# Altium schematic sheet LoraPic.SchDoc
size 420 x 297 mm; Address1: Address1; Address2: Address2; Address3: Address3; Address4: Address4; SheetNumber: 1; Scale: 1:1; Разраб.: Иванов; Обозначение документа: АБВГ.123456.001 Э3; Пров.: Петров; Утв.: Сидоров; Наименование организации: ОАО "Ваша фирма"; Перв. применение: АБВГ.123456.000; Наименование изделия 1: Плата; Наименование изделия 2: Схема электрическая; Наименование изделия 3: принципиальная; Нач. отд.: Нач. отд.; Фамилия нач. отд.: Сидоров
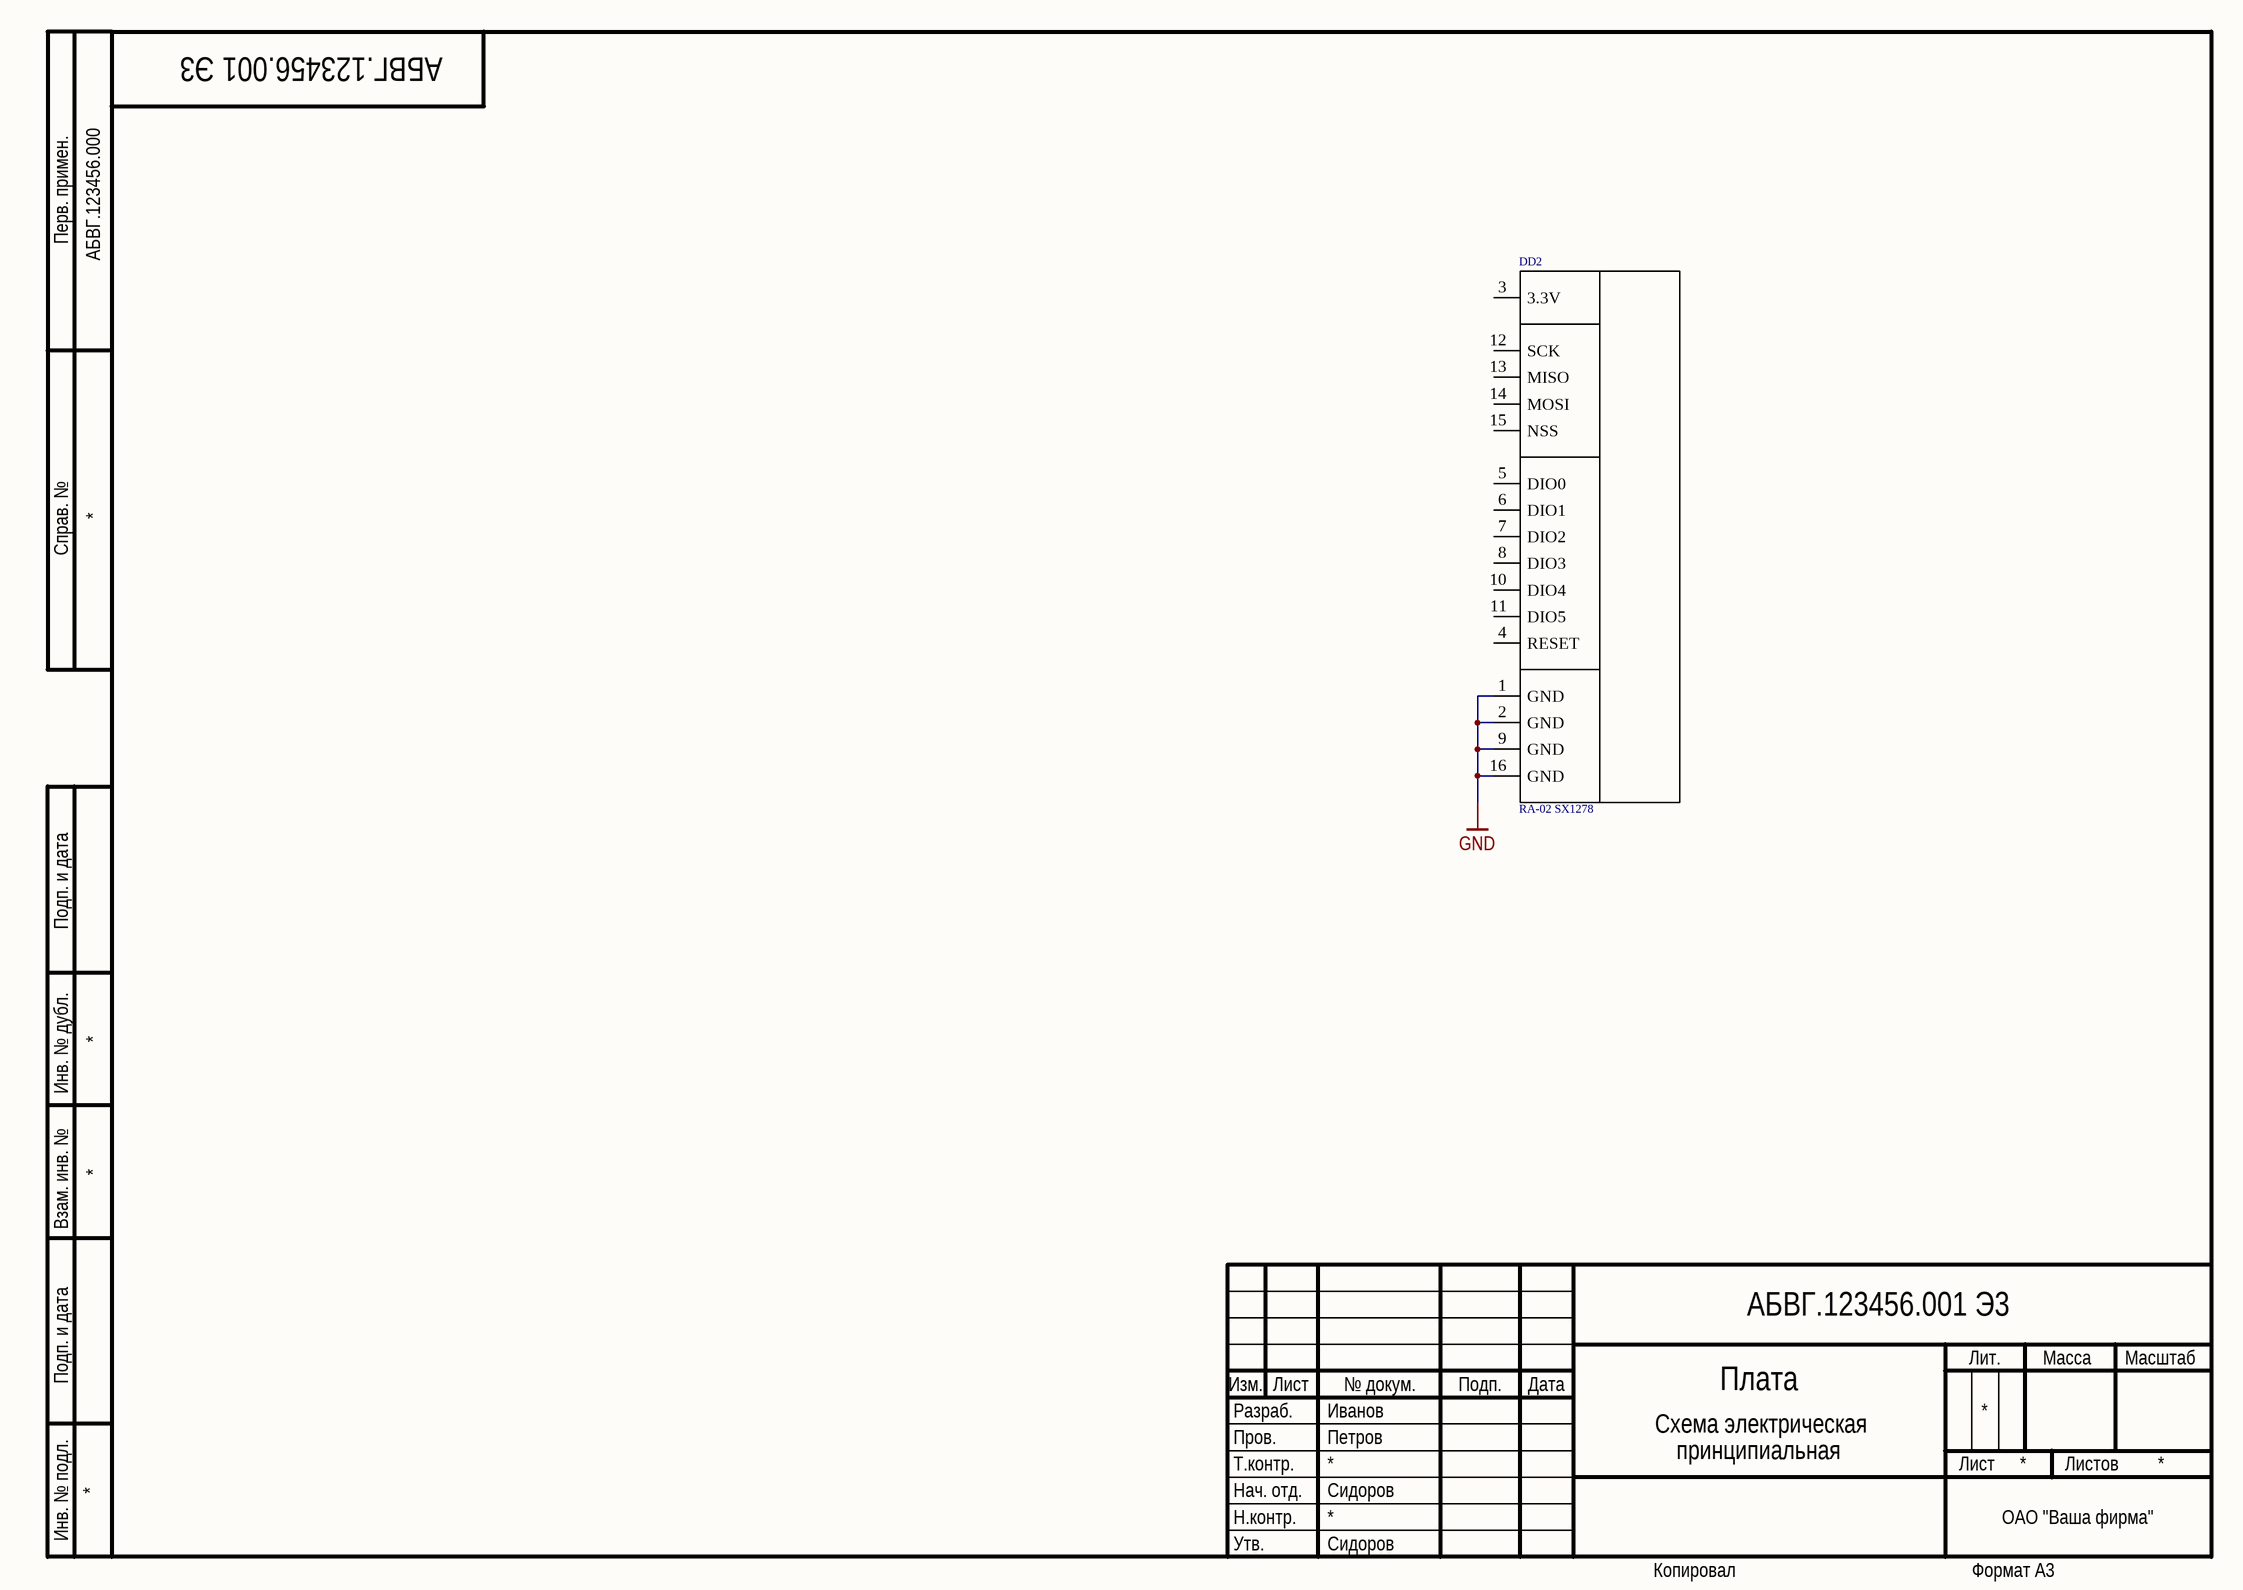
[diagram p0: LoraPic.SchDoc]

## Parts
DD2  RA-02 SX1278  [RA-02]

## Nets
GND: DD2.1(GND) DD2.2(GND) DD2.9(GND) DD2.16(GND)

Not connected (* = marked no-connect by the designer): DD2 3(3.3V) 4(RESET) 5(DIO0) 6(DIO1) 7(DIO2) 8(DIO3) 10(DIO4) 11(DIO5) 12(SCK) 13(MISO) 14(MOSI) 15(NSS)

## Notes on the sheet
- Перв. примен.
- Справ. №
- Подп. и дата
- Инв. № дубл.
- Взам. инв. №
- Разраб.
- Изм.
- Лист
- № докум.
- Подп.
- Дата
- Лит.
- Масса
- Масштаб
- Пров.
- Т.контр.
- Листов
- Инв. № подл.
- Утв.
- Н.контр.
- Копировал
- Формат А3

## Library data of the parts
DD2 = RA-02